# EAGLE design audio_breakout (EAGLE 6.4)
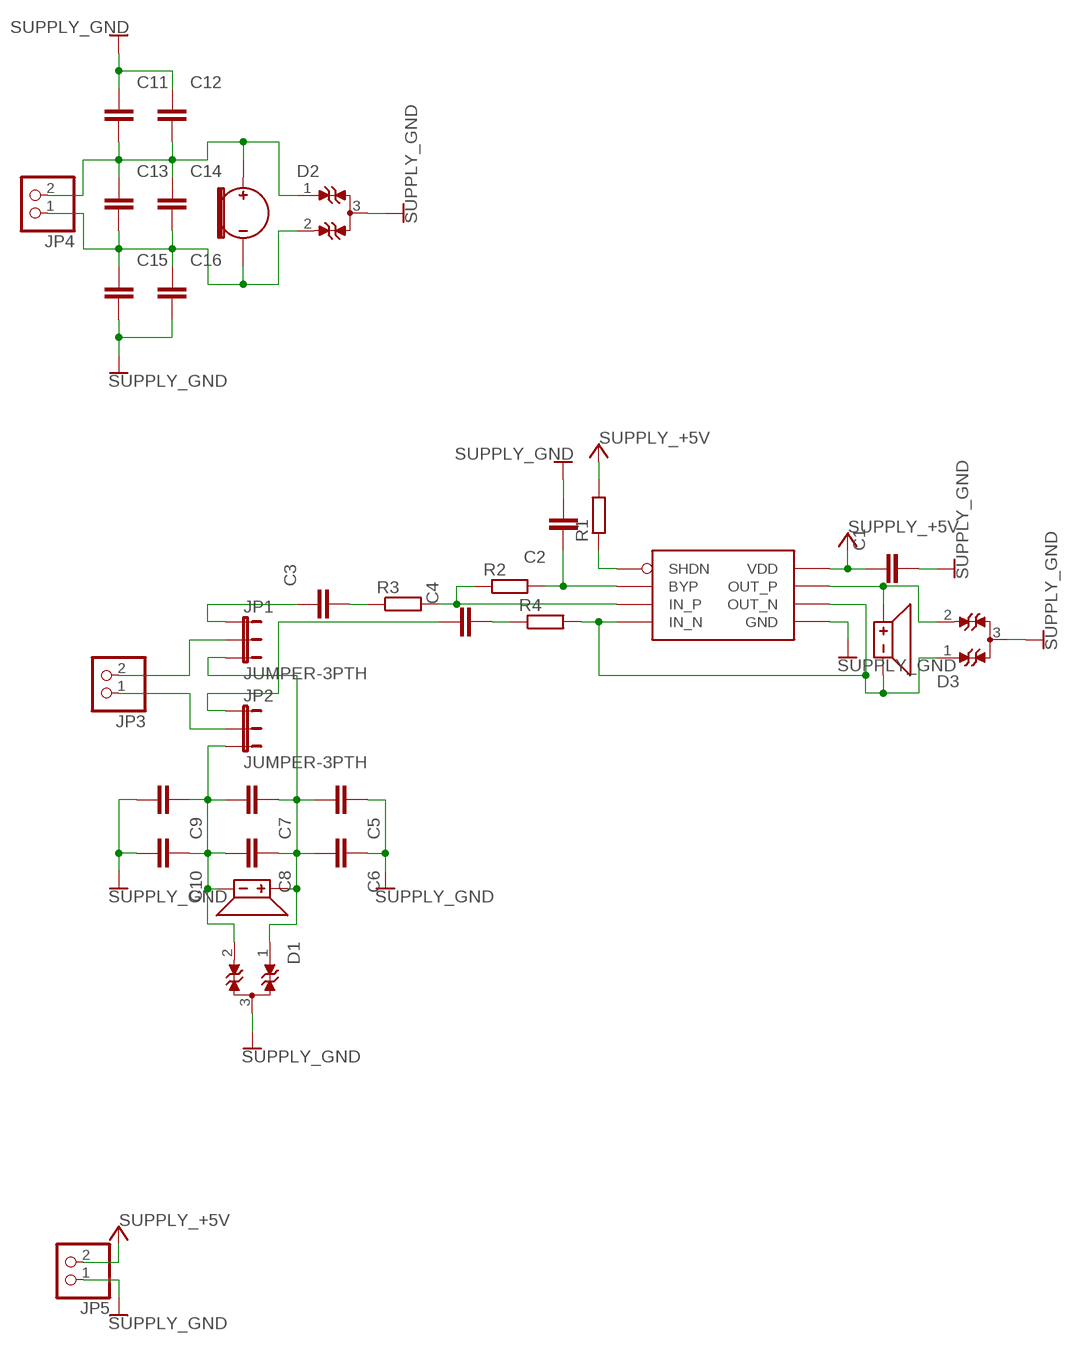
[diagram p0: schematic, sheet 1]

## Parts
C1  CAPACITOR_NPOL-0603  [C603]
C2  CAPACITOR_NPOL-0603  [C603]
C3  CAPACITOR_NPOL-0603  [C603]
C4  CAPACITOR_NPOL-0603  [C603]
C5  CAPACITOR_NPOL-0603  [C603]
C6  CAPACITOR_NPOL-0603  [C603]
C7  CAPACITOR_NPOL-0603  [C603]
C8  CAPACITOR_NPOL-0603  [C603]
C9  CAPACITOR_NPOL-0603  [C603]
C10  CAPACITOR_NPOL-0603  [C603]
C11  CAPACITOR_NPOL-0603  [C603]
C12  CAPACITOR_NPOL-0603  [C603]
C13  CAPACITOR_NPOL-0603  [C603]
C14  CAPACITOR_NPOL-0603  [C603]
C15  CAPACITOR_NPOL-0603  [C603]
C16  CAPACITOR_NPOL-0603  [C603]
D1  WE-TVS_824022  [WE-TVS_SOT23-3L]
D2  WE-TVS_824022  [WE-TVS_SOT23-3L]
D3  WE-TVS_824022  [WE-TVS_SOT23-3L]
JP1  JUMPER-3PTH  [1X03]
JP2  JUMPER-3PTH  [1X03]
JP3  PINHD-1X2  [1X02]
JP4  PINHD-1X2  [1X02]
JP5  PINHD-1X2  [1X02]
R1  RESISTOR-0603  [R603]
R2  RESISTOR-0603  [R603]
R3  RESISTOR-0603  [R603]
R4  RESISTOR-0603  [R603]
U$1  LM4890  [SOIC-8-NARROW]
U$2  SPEAKER-2403-260-00001  [2403-260-00001]
U$3  SPEAKER-2403-260-00031  [2403-260-00031]
U$4  MIC-ELECTRET-9.7MM  [9.7MM-ELECTRET]

## Nets
+5V: C1.1 JP5.2 R1.2 U$1.6(VDD) ; supply symbol labelled SUPPLY_+5V
GND: C1.2 C2.2 C5.1 C6.1 C9.2 C10.2 C11.1 C12.1 C15.2 C16.2 D1.3(GND) D2.3(GND) D3.3(GND) JP5.1 U$1.7(GND) ; supply symbol labelled SUPPLY_GND
N$1: R1.1 U$1.1(SHDN)
N$2: C2.1 R2.2 U$1.2(BYP)
N$3: R2.1 R3.2 U$1.3(IN_P)
N$4: D3.1 R4.2 U$1.4(IN_N) U$1.5(OUT_N) U$2.-
N$6: D3.2 U$1.8(OUT_P) U$2.+
N$7: C3.2 R3.1
N$8: C4.2 R4.1
N$10: C5.2 C6.2 C7.1 C8.1 D1.1 JP1.3 U$3.+
N$11: C3.1 JP1.1
N$12: C4.1 JP2.1
N$13: C7.2 C8.2 C9.1 C10.1 D1.2 JP2.3 U$3.-
N$14: JP1.2 JP3.2
N$15: JP2.2 JP3.1
N$18: C11.2 C12.2 C13.1 C14.1 D2.1 JP4.2 U$4.+
N$19: C13.2 C14.2 C15.1 C16.1 D2.2 JP4.1 U$4.-

## Library data of the parts
C1-C16 = dp_devices:CAPACITOR_NPOL: Non-Polarized capacitor in various packages
D1-D3 = WE-TVS_824022:WE-TVS_824022: TVS Diode Array WE-TVS, Standard Series - Low capazity - No leakage current - Low clamping voltage - high ESD voltage protection - Uni- and bidirectional protection -- DC Distribution -- Headsets and Accessoires -- PDAs -- Digital Cameras -- MP3-Players -- Touch Panels; MPN: 824022; OC_FARNELL: 1748618; OC_NEWARK: 34R6124; PACKAGE: SOT23-3L; SUPPLIER: Wuerth Elektronik
JP1 JP2 = SparkFun-Passives:JUMPER-3
JP3-JP5 = pinhead:PINHD-1X2: PIN HEADER
R1-R4 = dp_devices:RESISTOR
U$1 = customParts:LM4890
U$2 U$3 = customParts:SPEAKER
U$4 = customParts:MIC

## Board
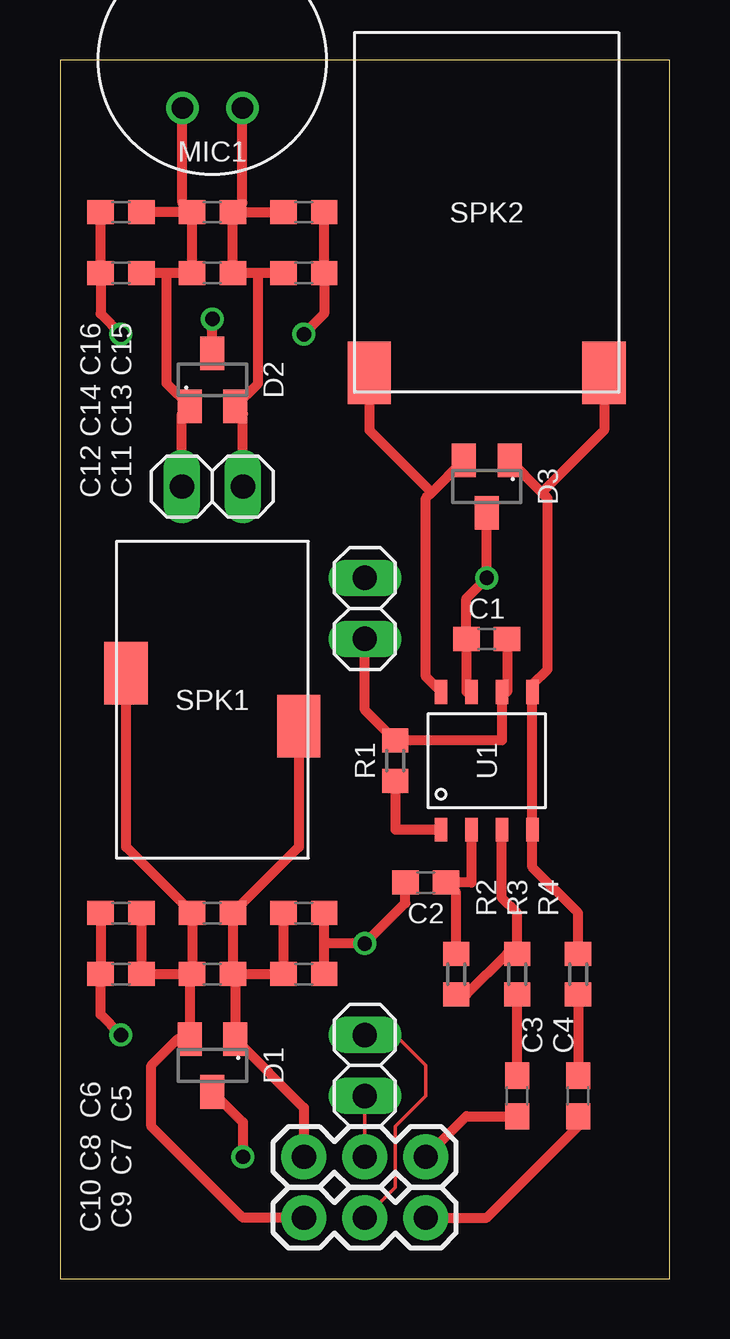
[diagram p1: board, top side]
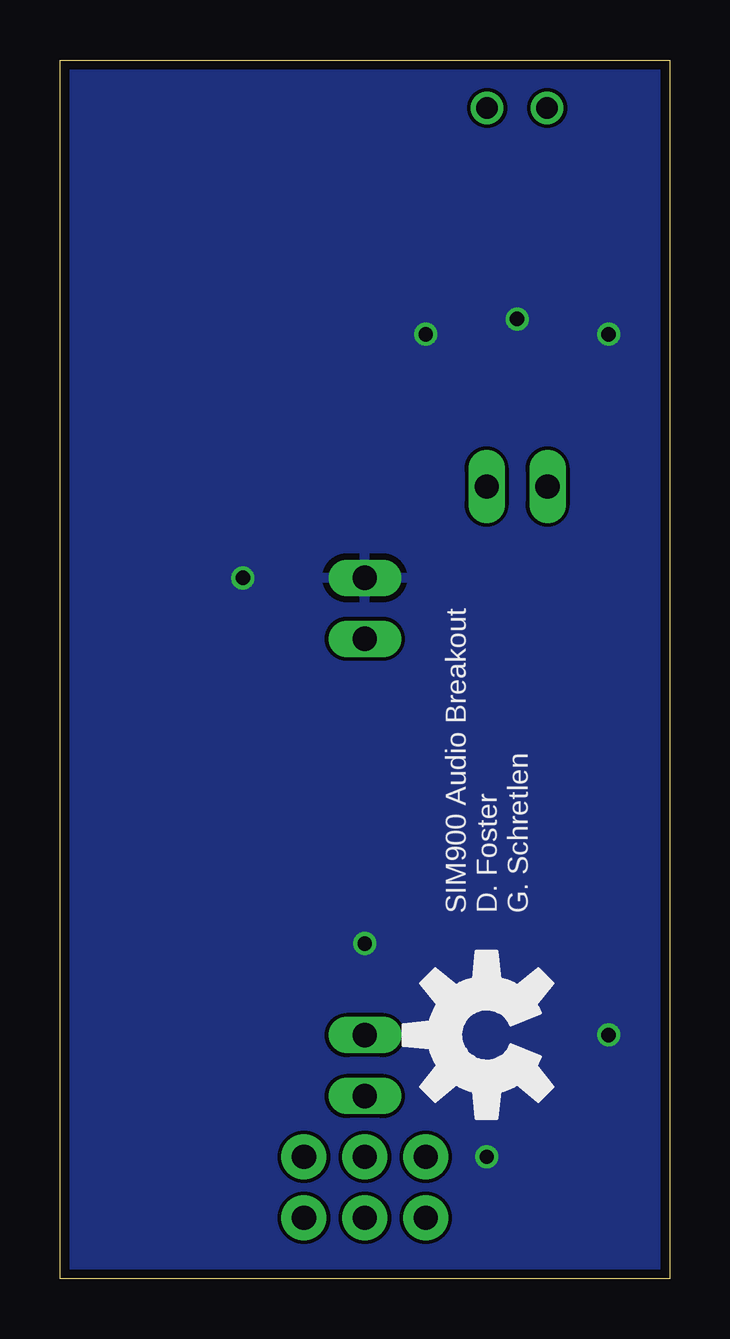
[diagram p2: board, bottom side, seen from below]

Size 25.4 x 50.8 mm. Coordinates in mm from the lower left corner, seen from the top.
Outline: 0,0 25.4,0 25.4,50.8 0,50.8 0,0
Copper layers (1*16): Top 0.0356mm / dielectric 1.5011mm / Bottom 0.0356mm
Design rules "LaenPCBOrder *": minimum track width 6mil, minimum drill 13mil, track to track 6mil, track to pad 6mil, pad to pad 6mil, via to via 6mil, smd to smd 6mil, copper to edge 15mil, drill to drill 6mil, minimum pad ring 7mil, minimum via ring 7mil, stop-mask expansion 4mil, vias tented up to drill 25mil, thermal gap 10mil

### Footprints (pad centres in the part's own frame; a part is rotated, then mirrored left to right if it is on the bottom)
C603 = smd 1.1 x 1: 1 -0.85,0; 2 0.85,0
WE-TVS_SOT23-3L = smd 1 x 1.4: 1 -0.95,-1.1; 2 0.95,-1.1; 3 0,1.1
1X03 = drill 1.016 pad 1.88: 1 0,0; 2 2.54,0; 3 5.08,0
1X02 = drill 1.016 long: 1 -1.27,0; 2 1.27,0
R603 = smd 1 x 1.1: 1 -0.85,0; 2 0.85,0
SOIC-8-NARROW = smd 0.508 x 0.991: 1 -1.905,-2.87; 2 -0.635,-2.87; 3 0.635,-2.87; 4 1.905,-2.87; 5 1.905,2.87; 6 0.635,2.87; 7 -0.635,2.87; 8 -1.905,2.87
2403-260-00001 = smd 2.6 x 1.8: + 6.7,-4.89; - 6.7,4.89
2403-260-00031 = smd 2.6 x 1.8: + -1.1,-3.6; - 1.1,3.6
9.7MM-ELECTRET = drill 0.9: + 2,-1.25; - 2,1.25

### Placement (x,y rotation side)
C1  17.78,26.67 180 top
C2  15.24,16.51 180 top
C3  19.05,7.62 90 top
C4  21.59,7.62 90 top
C5  10.16,12.7 180 top
C6  10.16,15.24 180 top
C7  6.35,12.7 180 top
C8  6.35,15.24 180 top
C9  2.54,12.7 180 top
C10  2.54,15.24 180 top
C11  2.54,41.91 0 top
C12  2.54,44.45 0 top
C13  6.35,41.91 0 top
C14  6.35,44.45 0 top
C15  10.16,41.91 0 top
C16  10.16,44.45 0 top
D1  6.35,8.89 180 top
D2  6.35,37.47 0 top
D3  17.78,33.02 180 top
JP1  15.24,5.08 180 top
JP2  15.24,2.54 180 top
JP3  12.7,8.89 270 top
JP4  6.35,33.02 180 top
JP5  12.7,27.94 270 top
R1  13.97,21.59 90 top
R2  16.51,12.7 90 top
R3  19.05,12.7 90 top
R4  21.59,12.7 90 top
U$1  17.78,21.59 0 top
U$2  17.78,44.45 270 top
U$3  6.35,24.13 90 top
U$4  6.35,50.8 270 top
U$6  [OSHW-LOGO-L]  7.62,10.16 90 bottom

### Tracks (layer width: path | path; a pad name or v marks a point on that pad's centre or on a via)
+5V
  Top 0.406: C1.1 18.63,24.46 U$1.6 18.41,22.44 R1.2 12.7,23.71 JP5.2
GND  (via drill 0.6)
  Top 0.406: U$1.7 16.93,24.46 C1.2 16.93,28.36 v17.78,29.21 D3.3 | C5.1 11.01,13.97 | 11.01,13.97 C6.1 | C10.2 C9.2 1.69,11.01 v2.54,10.16 | D1.3 7.62,6.52 v7.62,5.08 | 11.01,13.97 v12.7,13.97 14.39,15.66 C2.2 | D2.3 v6.35,40.01 | v2.54,39.37 1.69,40.22 C11.1 C12.1 | v10.16,39.37 11.01,40.22 C15.2 C16.2
  pour Bottom: 0,0 25.4,0 25.4,50.8 0,50.8
N$1
  Top 0.406: R1.1 13.97,18.72 U$1.1
N$2
  Top 0.406: U$1.2 17.14,16.51 C2.1 16.51,16.09 R2.2
N$3
  Top 0.406: R2.1 16.93,11.85 18.63,13.55 R3.2 19.05,15.24 18.41,15.88 U$1.3
N$4
  Top 0.406: R4.2 21.59,15.24 19.68,17.14 U$1.4 U$1.5 19.68,24.77 20.32,25.4 20.32,32.53 20.07,32.77 | 20.07,32.77 D3.1 | U$2.- 22.67,35.37 20.07,32.77
N$6
  Top 0.406: U$1.8 15.24,25.09 15.24,32.53 15.48,32.77 | 15.48,32.77 D3.2 | U$2.+ 12.89,35.37 15.48,32.77
N$7
  Top 0.406: C3.2 R3.1
N$8
  Top 0.406: R4.1 C4.2
N$10
  Top 0.406: C6.2 C5.2 7.4,12.7 7.3,12.6 | U$3.+ 9.95,17.99 C8.1 C7.1 7.3,12.6 | 7.3,12.6 D1.1 10.16,7.13 JP1.3
N$11
  Top 0.406: JP1.1 16.93,6.77 C3.1
N$12
  Top 0.406: JP2.1 17.78,2.54 21.59,6.35 C4.1
N$13
  Top 0.406: C10.1 C9.1 C7.2 | U$3.- 2.75,17.99 C8.2 C7.2 | C7.2 5.4,12.6 D1.2 4.91,9.99 3.81,8.89 3.81,6.35 7.62,2.54 JP2.3
N$14
  Top 0.152: JP1.2 JP3.2
N$15
  Top 0.152: JP2.2 13.97,3.81 13.97,6.35 15.24,7.62 15.24,8.89 13.97,10.16 JP3.1
N$18
  Top 0.406: C14.1 C13.1 4.45,41.91 | C14.1 C12.2 | C14.1 5.1,44.85 U$4.+ | JP4.2 5.08,36.05 D2.1 4.45,37.32 4.45,41.91 | 4.45,41.91 C11.2
N$19
  Top 0.406: C14.2 C13.2 8.26,41.91 | C14.2 C16.1 | C14.2 7.6,44.85 U$4.- | JP4.1 7.62,36.05 D2.2 8.26,37.32 8.26,41.91 | C15.1 8.26,41.91

### Text on the board
tPlace: MIC1 | SPK2 | D2 | C12 C14 C16 / C11 C13 C15 | D3 | C1 | SPK1 | R1 | U1 | R2 / R3 / R4 | C2 | C3 / C4 | D1 | C10 C8 C6 / C9 C7 C5
bPlace: SIM900 Audio Breakout / D. Foster / G. Schretlen